# Altium schematic sheet Sheet1.SchDoc
size 635 x 508 mm; SheetNumber: 1; SheetTotal: 12
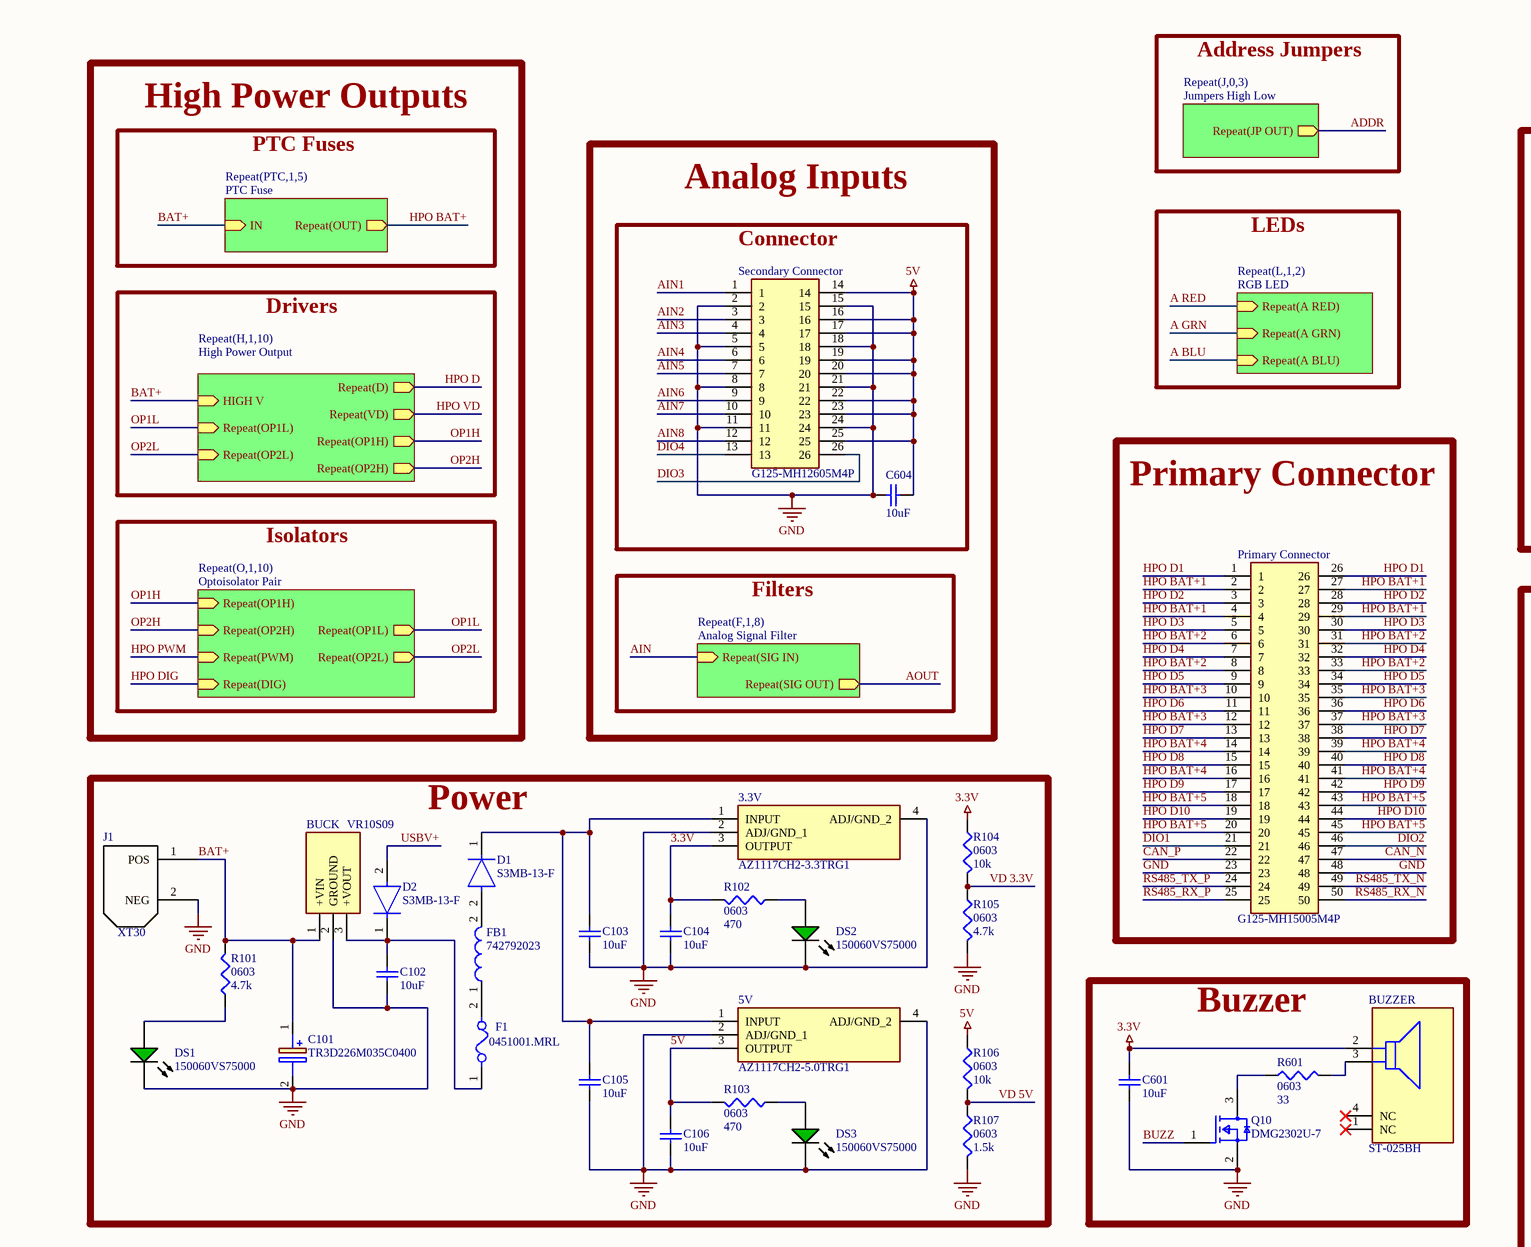
[diagram p0: Sheet1.SchDoc, top left]
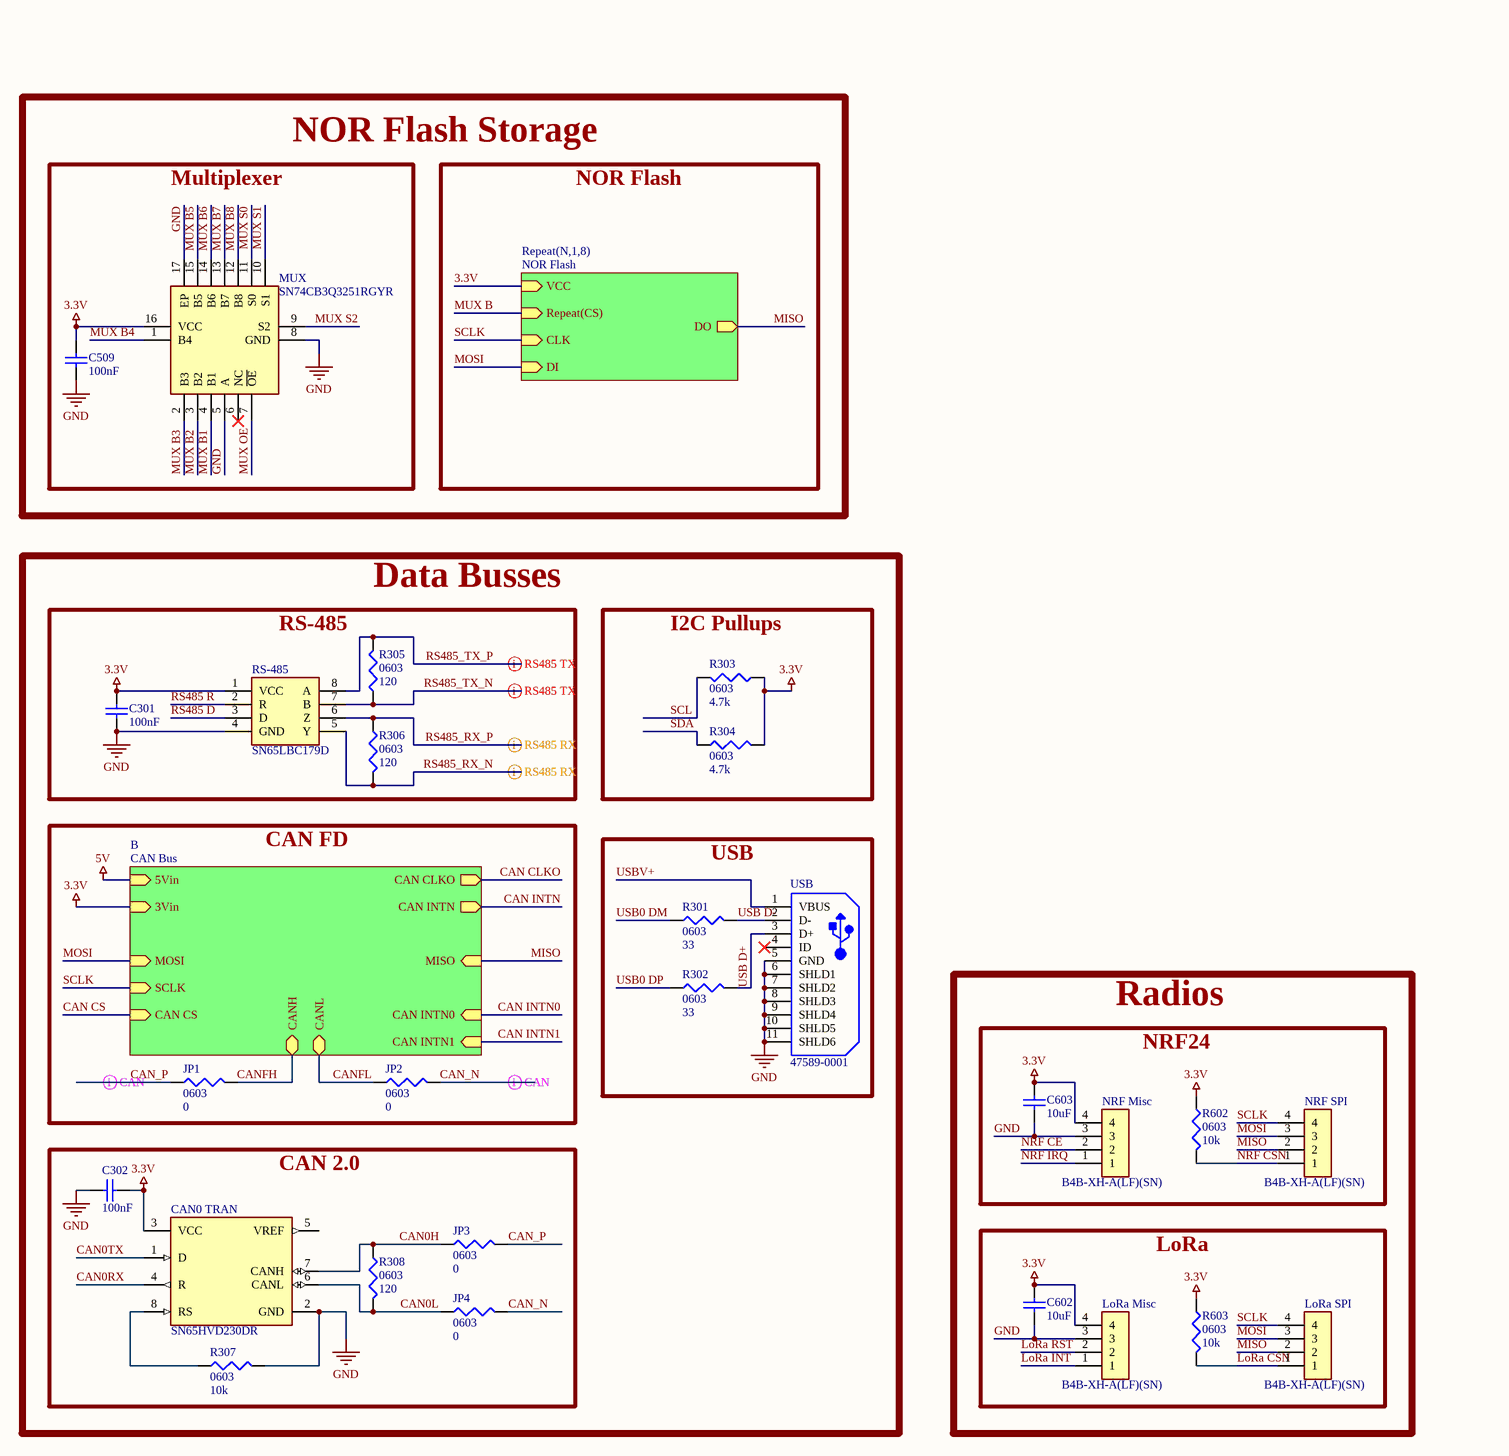
[diagram p1: Sheet1.SchDoc, top right]
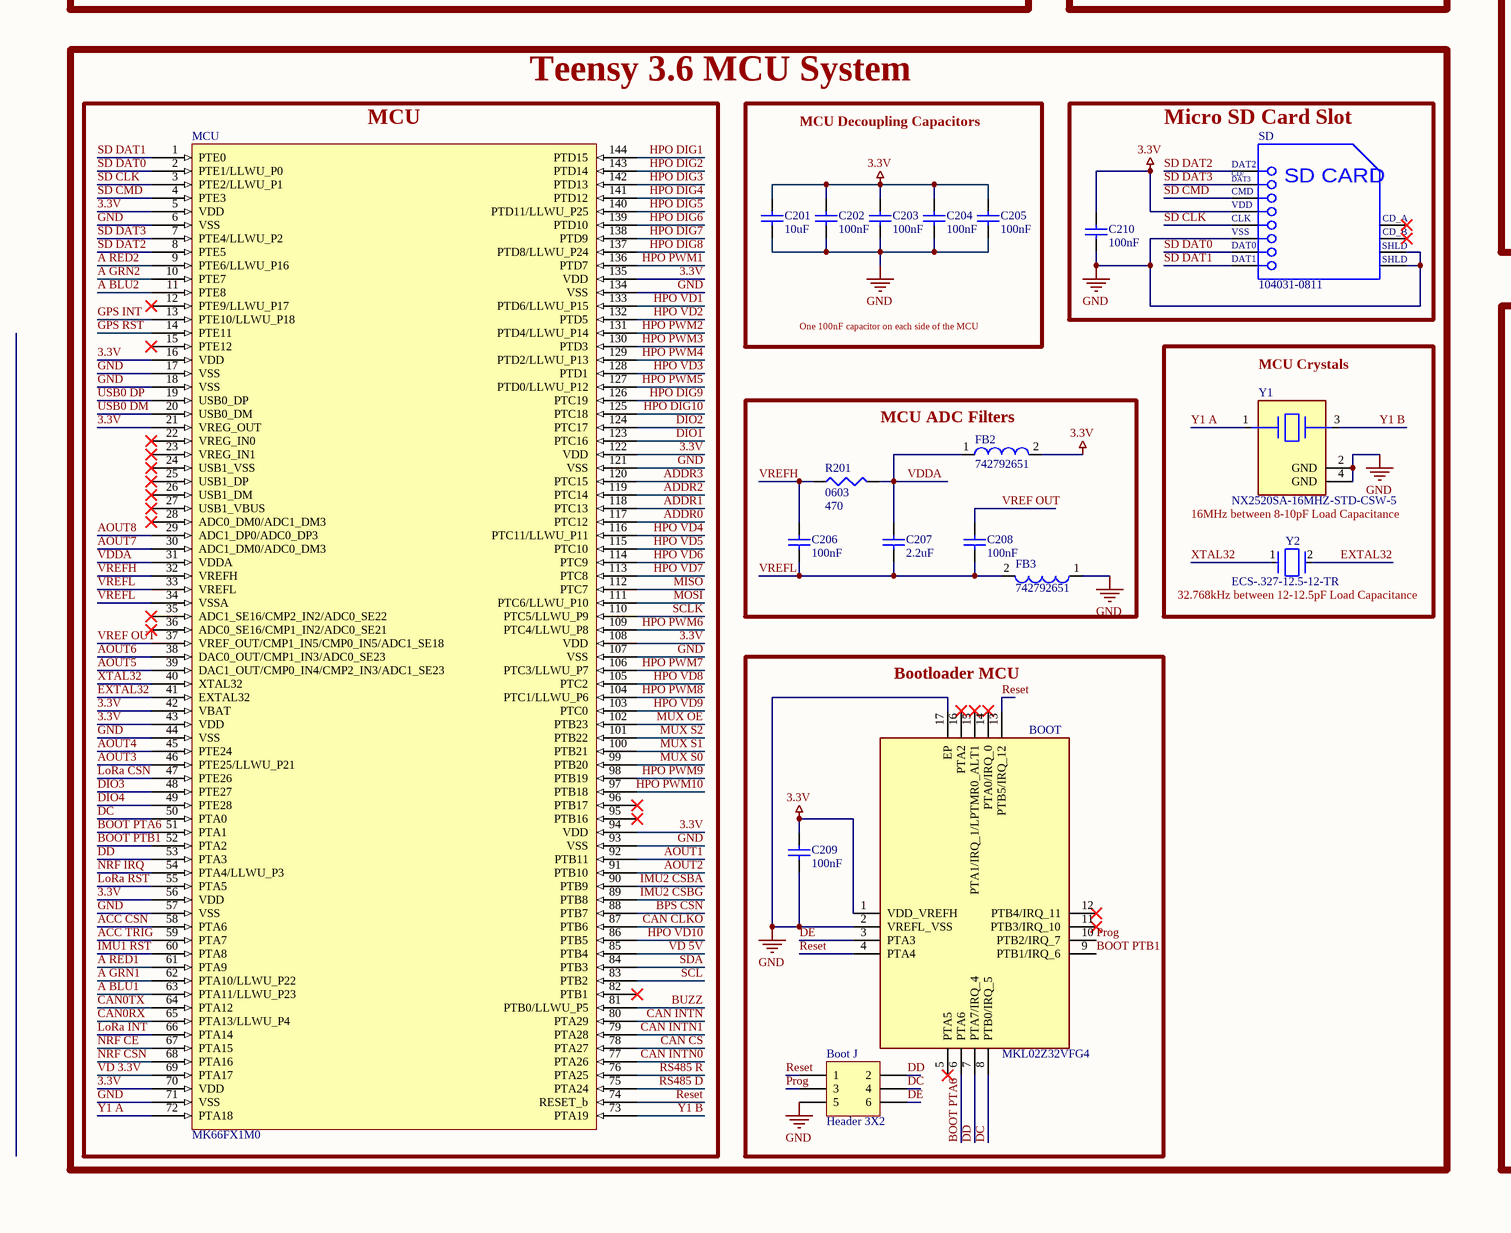
[diagram p2: Sheet1.SchDoc, bottom left]
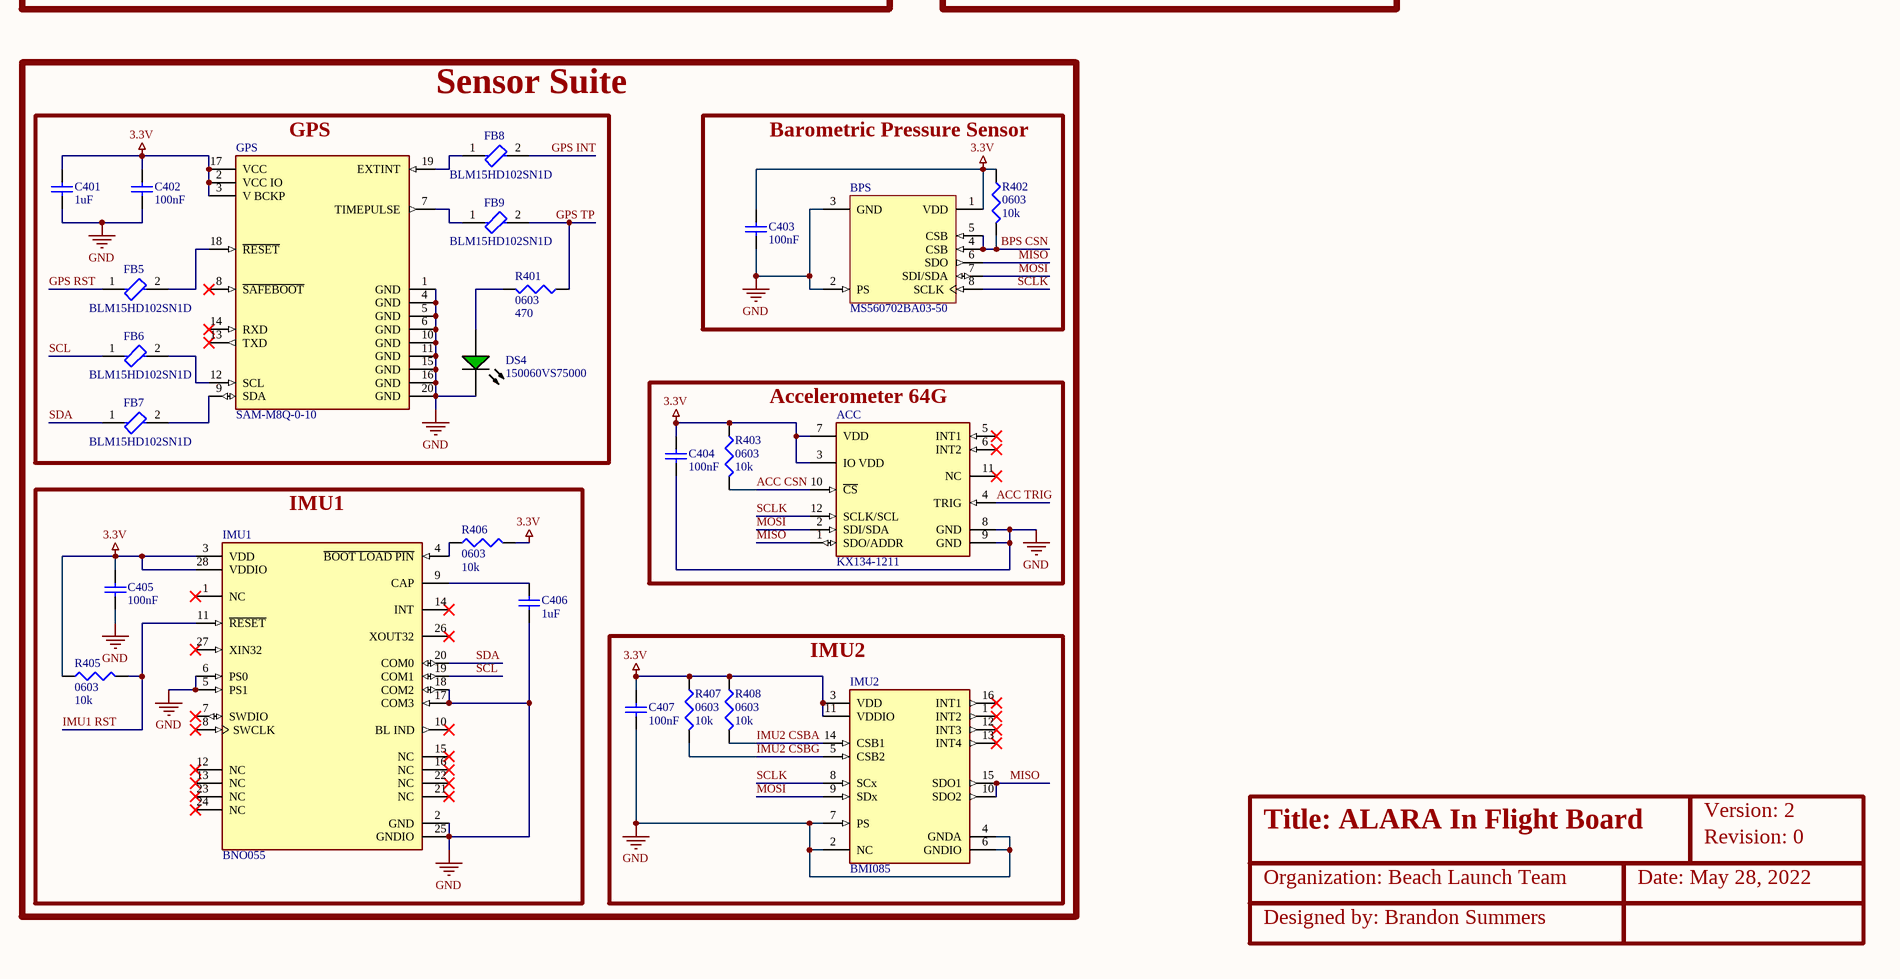
[diagram p3: Sheet1.SchDoc, bottom right]

## Parts
3.3V  AZ1117CH2-3.3TRG1  [SOT230P700X180-4N]
5V  AZ1117CH2-5.0TRG1  [SOT230P700X180-4N]
ACC  KX134-1211  [FP-KX134-1211-MFG]
BOOT  MKL02Z32VFG4  [QFN50P300X300X65-17N-D]
Boot_J  Header 3X2  [HDR2X3]
BPS  MS560702BA03-50  [TECO-MS560702BA03-50_V]
BUCK  VR10S09  [VR10S09]
BUZZER  ST-025BH  [FP-ST-025BH-MFG]
C101  TR3D226M035C0400  [CAPPM7343X310N]
C102  10uF  [CAPC1608X95X40ML15T15]
C103  10uF  [CAPC1608X95X40ML15T15]
C104  10uF  [CAPC1608X95X40ML15T15]
C105  10uF  [CAPC1608X95X40ML15T15]
C106  10uF  [CAPC1608X95X40ML15T15]
C201  10uF  [CAPC1608X95X40ML15T15]
C202  100nF  [CAPC1608X95X40ML15T15]
C203  100nF  [CAPC1608X95X40ML15T15]
C204  100nF  [CAPC1608X95X40ML15T15]
C205  100nF  [CAPC1608X95X40ML15T15]
C206  100nF  [CAPC1608X95X40ML15T15]
C207  2.2uF  [CAPC1608X95X40ML15T15]
C208  100nF  [CAPC1608X95X40ML15T15]
C209  100nF  [CAPC1608X95X40ML15T15]
C210  100nF  [CAPC1608X95X40ML15T15]
C301  100nF  [CAPC1608X95X40ML15T15]
C302  100nF  [CAPC1608X95X40ML15T15]
C401  1uF  [CAPC1608X95X40ML15T15]
C402  100nF  [CAPC1608X95X40ML15T15]
C403  100nF  [CAPC1608X95X40ML15T15]
C404  100nF  [CAPC1608X95X40ML15T15]
C405  100nF  [CAPC1608X95X40ML15T15]
C406  1uF  [CAPC1608X95X40ML15T15]
C407  100nF  [CAPC1608X95X40ML15T15]
C509  100nF  [CAPC1608X95X40ML15T15]
C601  10uF  [CAPC1608X95X40ML15T15]
C602  10uF  [CAPC1608X95X40ML15T15]
C603  10uF  [CAPC1608X95X40ML15T15]
C604  10uF  [CAPC1608X95X40ML15T15]
CAN0_TRAN  SN65HVD230DR  [FP-D0008A-IPC_A]
D1  S3MB-13-F  [FP-SMB-MFG]
D2  S3MB-13-F  [FP-SMB-MFG]
DS1  150060VS75000  [WE-150060VS75000_V]
DS2  150060VS75000  [WE-150060VS75000_V]
DS3  150060VS75000  [WE-150060VS75000_V]
DS4  150060VS75000  [WE-150060VS75000_V]
F1  0451001.MRL  [FP-0451-MFG]
FB1  742792023  [SMD-0805]
FB2  742792651  [SMD-0603]
FB3  742792651  [SMD-0603]
FB5  BLM15HD102SN1D  [FP-BLM15-0_05-IPC_C]
FB6  BLM15HD102SN1D  [FP-BLM15-0_05-IPC_C]
FB7  BLM15HD102SN1D  [FP-BLM15-0_05-IPC_C]
FB8  BLM15HD102SN1D  [FP-BLM15-0_05-IPC_C]
FB9  BLM15HD102SN1D  [FP-BLM15-0_05-IPC_C]
GPS  SAM-M8Q-0-10  [FP-SAM-M8Q-0-10-MFG]
IMU1  BNO055  [FP-BNO055-MFG]
IMU2  BMI085  [FP-BMI055-MFG]
J1  XT30  [XT30]
JP1  0603  value 0  [J1-0603]
JP2  0603  value 0  [J1-0603]
JP3  0603  value 0  [J1-0603]
JP4  0603  value 0  [J1-0603]
LoRa_Misc  B4B-XH-A(LF)(SN)  [JST_B4B-XH-A(LF)(SN)]
LoRa_SPI  B4B-XH-A(LF)(SN)  [JST_B4B-XH-A(LF)(SN)]
MCU  MK66FX1M0  [LQFP144 0.5mm Pitch]
MUX  SN74CB3Q3251RGYR  [SN74CBT3257CRGYR]
NRF_Misc  B4B-XH-A(LF)(SN)  [JST_B4B-XH-A(LF)(SN)]
NRF_SPI  B4B-XH-A(LF)(SN)  [JST_B4B-XH-A(LF)(SN)]
Primary_Connector  G125-MH15005M4P  [G125-MH15005M4P]
Q10  DMG2302U-7  [FP-SOT23-MFG]
R101  0603  value 4.7k  [J1-0603]
R102  0603  value 470  [J1-0603]
R103  0603  value 470  [J1-0603]
R104  0603  value 10k  [J1-0603]
R105  0603  value 4.7k  [J1-0603]
R106  0603  value 10k  [J1-0603]
R107  0603  value 1.5k  [J1-0603]
R201  0603  value 470  [J1-0603]
R301  0603  value 33  [J1-0603]
R302  0603  value 33  [J1-0603]
R303  0603  value 4.7k  [J1-0603]
R304  0603  value 4.7k  [J1-0603]
R305  0603  value 120  [J1-0603]
R306  0603  value 120  [J1-0603]
R307  0603  value 10k  [J1-0603]
R308  0603  value 120  [J1-0603]
R401  0603  value 470  [J1-0603]
R402  0603  value 10k  [J1-0603]
R403  0603  value 10k  [J1-0603]
R405  0603  value 10k  [J1-0603]
R406  0603  value 10k  [J1-0603]
R407  0603  value 10k  [J1-0603]
R408  0603  value 10k  [J1-0603]
R601  0603  value 33  [J1-0603]
R602  0603  value 10k  [J1-0603]
R603  0603  value 10k  [J1-0603]
RS-485  SN65LBC179D  [SOIC127P600X175-8N]
SD  104031-0811  [MOLX-104031-0811_V]
Secondary_Connector  G125-MH12605M4P  [G125-MH12605M4P]
USB  47589-0001  [MOLX-47589-0001_V]
Y1  NX2520SA-16MHZ-STD-CSW-5  [FP-NX2520SA-MFG]
Y2  ECS-.327-12.5-12-TR  [FP-ECX-12-MFG]

## Blocks framed on the sheet
NOR Flash Storage: C509 MUX
Connector: C604 Secondary_Connector
Primary Connector: Primary_Connector
Data Busses: C301 R305 R306 RS-485
I2C Pullups: R303 R304
Power: 3.3V 5V BUCK C101-C106 D1 D2 DS1-DS3 F1 FB1 J1 R101-R107
CAN FD: JP1 JP2
USB: R301 R302 USB
Buzzer: BUZZER C601 Q10 R601
Radios: C603 NRF_Misc NRF_SPI R602
CAN 2.0: C302 CAN0_TRAN JP3 JP4 R307 R308
LoRa: C602 LoRa_Misc LoRa_SPI R603
Teensy 3.6 MCU System: MCU
MCU Decoupling Capacitors: C201-C205
Micro SD Card Slot: C210 SD
MCU Crystals: Y1 Y2
Sensor Suite: C401 C402 DS4 FB5-FB9 GPS R401
Barometric Pressure Sensor: BPS C403 R402
MCU ADC Filters: C206-C208 FB2 FB3 R201
Accelerometer 64G: ACC C404 R403
Bootloader MCU: BOOT Boot_J C209
IMU1: C405 C406 IMU1 R405 R406
IMU2: C407 IMU2 R407 R408

## Sub-sheets
B = CAN Bus: 5Vin (in), 3Vin (in), CANH (bidir), CANL (bidir), CAN CLKO (out), CAN INTN (out), SCLK (in), MOSI (in), CAN CS (in), MISO (in), CAN INTN0 (in), CAN INTN1 (in)
Repeat(F,1,8) = Analog Signal Filter: Repeat(SIG IN) (in), Repeat(SIG OUT) (out)
Repeat(H,1,10) = High Power Output: Repeat(VD) (out), Repeat(D) (out), HIGH V (in), Repeat(OP1L) (in), Repeat(OP2L) (in), Repeat(OP1H) (out), Repeat(OP2H) (out)
Repeat(J,0,3) = Jumpers High Low: Repeat(JP OUT) (out)
Repeat(L,1,2) = RGB LED: Repeat(A RED) (in), Repeat(A GRN) (in), Repeat(A BLU) (in)
Repeat(N,1,8) = NOR Flash: Repeat(CS) (in), DI (in), DO (out), CLK (in), VCC (in)
Repeat(O,1,10) = Optoisolator Pair: Repeat(PWM) (in), Repeat(DIG) (in), Repeat(OP1H) (in), Repeat(OP1L) (out), Repeat(OP2H) (in), Repeat(OP2L) (out)
Repeat(PTC,1,5) = PTC Fuse: IN (in), Repeat(OUT) (out)

## Nets
3.3V: 3.3V.3(OUTPUT) ACC.3(IO_VDD) ACC.7(VDD) BOOT.1(VDD_VREFH) BPS.1(VDD) BUZZER.2(+POLARITY) C104.2 C201.2 C202.2 C203.2 C204.2 C205.2 C209.2 C210.2 C301.2 C302.2 C401.2 C402.2 C403.2 C404.2 C405.2 C407.2 C509.1 C601.2 C602.2 C603.2 CAN0_TRAN.3(VCC) FB2.2 GPS.2(VCC_IO) GPS.3(V_BCKP) GPS.17(VCC) IMU1.3(VDD) IMU1.28(VDDIO) IMU2.3(VDD) IMU2.11(VDDIO) LoRa_Misc.4 MCU.5(VDD) MCU.16(VDD) MCU.21(VREG_OUT) MCU.42(VBAT) MCU.43(VDD) MCU.56(VDD) MCU.70(VDD) MCU.94(VDD) MCU.108(VDD) MCU.122(VDD) MCU.135(VDD) MUX.16(VCC) NRF_Misc.4 R102.2 R104.1 R303.1 R304.2 R402.1 R403.1 R405.1 R406.2 R407.1 R408.1 R602.1 R603.1 RS-485.1(VCC) SD.4(VDD) ; sheet Repeat(N,1,8)/VCC, sheet B/3Vin
5V: 5V.3(OUTPUT) C106.2 C604.2 R103.2 R106.1 Secondary_Connector.14 Secondary_Connector.16 Secondary_Connector.17 Secondary_Connector.19 Secondary_Connector.20 Secondary_Connector.22 Secondary_Connector.23 Secondary_Connector.25 ; sheet B/5Vin
GND: 3.3V.2(ADJ/GND_1) 3.3V.4(ADJ/GND_2) 5V.2(ADJ/GND_1) 5V.4(ADJ/GND_2) ACC.8(GND) ACC.9(GND) BOOT.2(VREFL_VSS) BOOT.17(EP) Boot_J.5 BPS.2(PS) BPS.3(GND) BUCK.2(GROUND) C101.2(-) C102.1 C103.1 C104.1 C105.1 C106.1 C201.1 C202.1 C203.1 C204.1 C205.1 C209.1 C210.1 C301.1 C302.1 C401.1 C402.1 C403.1 C404.1 C405.1 C406.1 C407.1 C509.2 C601.1 C602.1 C603.1 C604.1 CAN0_TRAN.2(GND) DS1.1(K) DS2.1(K) DS3.1(K) DS4.1(K) FB3.1 GPS.1(GND) GPS.4(GND) GPS.5(GND) GPS.6(GND) GPS.10(GND) GPS.11(GND) GPS.15(GND) GPS.16(GND) GPS.20(GND) IMU1.2(GND) IMU1.5(PS1) IMU1.6(PS0) IMU1.17(COM3) IMU1.18(COM2) IMU1.25(GNDIO) IMU2.2(NC) IMU2.4(GNDA) IMU2.6(GNDIO) IMU2.7(PS) J1.2(NEG) LoRa_Misc.3 MCU.6(VSS) MCU.17(VSS) MCU.18(VSS) MCU.44(VSS) MCU.57(VSS) MCU.71(VSS) MCU.93(VSS) MCU.107(VSS) MCU.121(VSS) MCU.134(VSS) MUX.5(A) MUX.8(GND) MUX.17(EP) NRF_Misc.3 Primary_Connector.23 Primary_Connector.48 Q10.2(S) R105.2 R107.2 R307.2 RS-485.4(GND) SD.6(VSS2) SD.11(SHLD1) SD.12(SHLD2) Secondary_Connector.2 Secondary_Connector.5 Secondary_Connector.8 Secondary_Connector.11 Secondary_Connector.15 Secondary_Connector.18 Secondary_Connector.21 Secondary_Connector.24 USB.5(GND) USB.6(SHLD1) USB.7(SHLD2) USB.8(SHLD3) USB.9(SHLD4) USB.10(SHLD5) USB.11(SHLD6) Y1.2(GND) Y1.4(GND)
A BLU: sheet Repeat(L,1,2)/Repeat(A BLU)
A BLU1: MCU.63(PTA11/LLWU_P23)
A BLU2: MCU.11(PTE8)
A GRN: sheet Repeat(L,1,2)/Repeat(A GRN)
A GRN1: MCU.62(PTA10/LLWU_P22)
A GRN2: MCU.10(PTE7)
A RED: sheet Repeat(L,1,2)/Repeat(A RED)
A RED1: MCU.61(PTA9)
A RED2: MCU.9(PTE6/LLWU_P16)
ACC CSN: ACC.10(~{CS}) MCU.58(PTA6) R403.2
ACC TRIG: ACC.4(TRIG) MCU.59(PTA7)
ADDR: sheet Repeat(J,0,3)/Repeat(JP OUT)
ADDR0: MCU.117(PTC12)
ADDR1: MCU.118(PTC13)
ADDR2: MCU.119(PTC14)
ADDR3: MCU.120(PTC15)
AIN: sheet Repeat(F,1,8)/Repeat(SIG IN)
AIN1: Secondary_Connector.1
AIN2: Secondary_Connector.3
AIN3: Secondary_Connector.4
AIN4: Secondary_Connector.6
AIN5: Secondary_Connector.7
AIN6: Secondary_Connector.9
AIN7: Secondary_Connector.10
AIN8: Secondary_Connector.12
AOUT: sheet Repeat(F,1,8)/Repeat(SIG OUT)
AOUT1: MCU.92(PTB11)
AOUT2: MCU.91(PTB10)
AOUT3: MCU.46(PTE25/LLWU_P21)
AOUT4: MCU.45(PTE24)
AOUT5: MCU.39(DAC1_OUT/CMP0_IN4/CMP2_IN3/ADC1_SE23)
AOUT6: MCU.38(DAC0_OUT/CMP1_IN3/ADC0_SE23)
AOUT7: MCU.30(ADC1_DM0/ADC0_DM3)
AOUT8: MCU.29(ADC1_DP0/ADC0_DP3)
BAT+: BUCK.1(+VIN) C101.1(+) J1.1(POS) R101.2 ; sheet Repeat(H,1,10)/HIGH V, sheet Repeat(PTC,1,5)/IN
BOOT PTA6: BOOT.6(PTA6) MCU.51(PTA1)
BOOT PTB1: BOOT.9(PTB1/IRQ_6) MCU.52(PTA2)
BPS CSN: BPS.4(CSB) BPS.5(CSB) MCU.88(PTB7) R402.2
BUZZ: MCU.81(PTB0/LLWU_P5) Q10.1(G)
CAN0H: CAN0_TRAN.7(CANH) JP3.1 R308.1
CAN0L: CAN0_TRAN.6(CANL) JP4.1 R308.2
CAN0RX: CAN0_TRAN.4(R) MCU.65(PTA13/LLWU_P4)
CAN0TX: CAN0_TRAN.1(D) MCU.64(PTA12)
CAN CLKO: MCU.87(PTB6) ; sheet B/CAN CLKO
CAN CS: MCU.78(PTA27) ; sheet B/CAN CS
CAN INTN: MCU.80(PTA29) ; sheet B/CAN INTN
CAN INTN0: MCU.77(PTA26) ; sheet B/CAN INTN0
CAN INTN1: MCU.79(PTA28) ; sheet B/CAN INTN1
CAN_N: JP2.2 JP4.2 Primary_Connector.47
CAN_P: JP1.1 JP3.2 Primary_Connector.22
CANFH: JP1.2 ; sheet B/CANH
CANFL: JP2.1 ; sheet B/CANL
DC: BOOT.8(PTB0/IRQ_5) Boot_J.4 MCU.50(PTA0)
DD: BOOT.7(PTA7/IRQ_4) Boot_J.2 MCU.53(PTA3)
DE: BOOT.3(PTA3) Boot_J.6
DIO1: MCU.123(PTC16) Primary_Connector.21
DIO2: MCU.124(PTC17) Primary_Connector.46
DIO3: MCU.48(PTE27) Secondary_Connector.26
DIO4: MCU.49(PTE28) Secondary_Connector.13
EXTAL32: MCU.41(EXTAL32) Y2.2(Out/In)
GPS INT: FB8.2 MCU.13(PTE10/LLWU_P18)
GPS RST: FB5.1 MCU.14(PTE11)
GPS TP: FB9.2 R401.1
HPO BAT+: sheet Repeat(PTC,1,5)/Repeat(OUT)
HPO BAT+1: Primary_Connector.2 Primary_Connector.4 Primary_Connector.27 Primary_Connector.29
HPO BAT+2: Primary_Connector.6 Primary_Connector.8 Primary_Connector.31 Primary_Connector.33
HPO BAT+3: Primary_Connector.10 Primary_Connector.12 Primary_Connector.35 Primary_Connector.37
HPO BAT+4: Primary_Connector.14 Primary_Connector.16 Primary_Connector.39 Primary_Connector.41
HPO BAT+5: Primary_Connector.18 Primary_Connector.20 Primary_Connector.43 Primary_Connector.45
HPO D: sheet Repeat(H,1,10)/Repeat(D)
HPO D1: Primary_Connector.1 Primary_Connector.26
HPO D2: Primary_Connector.3 Primary_Connector.28
HPO D3: Primary_Connector.5 Primary_Connector.30
HPO D4: Primary_Connector.7 Primary_Connector.32
HPO D5: Primary_Connector.9 Primary_Connector.34
HPO D6: Primary_Connector.11 Primary_Connector.36
HPO D7: Primary_Connector.13 Primary_Connector.38
HPO D8: Primary_Connector.15 Primary_Connector.40
HPO D9: Primary_Connector.17 Primary_Connector.42
HPO D10: Primary_Connector.19 Primary_Connector.44
HPO DIG: sheet Repeat(O,1,10)/Repeat(DIG)
HPO DIG1: MCU.144(PTD15)
HPO DIG2: MCU.143(PTD14)
HPO DIG3: MCU.142(PTD13)
HPO DIG4: MCU.141(PTD12)
HPO DIG5: MCU.140(PTD11/LLWU_P25)
HPO DIG6: MCU.139(PTD10)
HPO DIG7: MCU.138(PTD9)
HPO DIG8: MCU.137(PTD8/LLWU_P24)
HPO DIG9: MCU.126(PTC19)
HPO DIG10: MCU.125(PTC18)
HPO PWM: sheet Repeat(O,1,10)/Repeat(PWM)
HPO PWM1: MCU.136(PTD7)
HPO PWM2: MCU.131(PTD4/LLWU_P14)
HPO PWM3: MCU.130(PTD3)
HPO PWM4: MCU.129(PTD2/LLWU_P13)
HPO PWM5: MCU.127(PTD0/LLWU_P12)
HPO PWM6: MCU.109(PTC4/LLWU_P8)
HPO PWM7: MCU.106(PTC3/LLWU_P7)
HPO PWM8: MCU.104(PTC1/LLWU_P6)
HPO PWM9: MCU.98(PTB19)
HPO PWM10: MCU.97(PTB18)
HPO VD: sheet Repeat(H,1,10)/Repeat(VD)
HPO VD1: MCU.133(PTD6/LLWU_P15)
HPO VD2: MCU.132(PTD5)
HPO VD3: MCU.128(PTD1)
HPO VD4: MCU.116(PTC11/LLWU_P11)
HPO VD5: MCU.115(PTC10)
HPO VD6: MCU.114(PTC9)
HPO VD7: MCU.113(PTC8)
HPO VD8: MCU.105(PTC2)
HPO VD9: MCU.103(PTC0)
HPO VD10: MCU.86(PTB5)
IMU1 RST: IMU1.11(~{RESET}) MCU.60(PTA8) R405.2
IMU2 CSBA: IMU2.14(CSB1) MCU.90(PTB9) R408.2
IMU2 CSBG: IMU2.5(CSB2) MCU.89(PTB8) R407.2
LoRa CSN: LoRa_SPI.1 MCU.47(PTE26) R603.2
LoRa INT: LoRa_Misc.1 MCU.66(PTA14)
LoRa RST: LoRa_Misc.2 MCU.55(PTA5)
MISO: ACC.1(SDO/ADDR) BPS.6(SDO) IMU2.10(SDO2) IMU2.15(SDO1) LoRa_SPI.2 MCU.112(PTC7) NRF_SPI.2 ; sheet Repeat(N,1,8)/DO, sheet B/MISO
MOSI: ACC.2(SDI/SDA) BPS.7(SDI/SDA) IMU2.9(SDx) LoRa_SPI.3 MCU.111(PTC6/LLWU_P10) NRF_SPI.3 ; sheet Repeat(N,1,8)/DI, sheet B/MOSI
MUX B: sheet Repeat(N,1,8)/Repeat(CS)
MUX B1: MUX.4(B1)
MUX B2: MUX.3(B2)
MUX B3: MUX.2(B3)
MUX B4: MUX.1(B4)
MUX B5: MUX.15(B5)
MUX B6: MUX.14(B6)
MUX B7: MUX.13(B7)
MUX B8: MUX.12(B8)
MUX OE: MCU.102(PTB23) MUX.7(~{OE})
MUX S0: MCU.99(PTB20) MUX.11(S0)
MUX S1: MCU.100(PTB21) MUX.10(S1)
MUX S2: MCU.101(PTB22) MUX.9(S2)
NRF CE: MCU.67(PTA15) NRF_Misc.2
NRF CSN: MCU.68(PTA16) NRF_SPI.1 R602.2
NRF IRQ: MCU.54(PTA4/LLWU_P3) NRF_Misc.1
OP1H: sheet Repeat(H,1,10)/Repeat(OP1H), sheet Repeat(O,1,10)/Repeat(OP1H)
OP1L: sheet Repeat(H,1,10)/Repeat(OP1L), sheet Repeat(O,1,10)/Repeat(OP1L)
OP2H: sheet Repeat(H,1,10)/Repeat(OP2H), sheet Repeat(O,1,10)/Repeat(OP2H)
OP2L: sheet Repeat(H,1,10)/Repeat(OP2L), sheet Repeat(O,1,10)/Repeat(OP2L)
Prog: BOOT.10(PTB2/IRQ_7) Boot_J.3
Reset: BOOT.4(PTA4) BOOT.13(PTB5/IRQ_12) Boot_J.1 MCU.74(RESET_b)
RS485 D: MCU.75(PTA24) RS-485.3(D)
RS485 R: MCU.76(PTA25) RS-485.2(R)
RS485_RX_N: Primary_Connector.50 R306.2 RS-485.5(Y)
RS485_RX_P: Primary_Connector.25 R306.1 RS-485.6(Z)
RS485_TX_N: Primary_Connector.49 R305.1 RS-485.7(B)
RS485_TX_P: Primary_Connector.24 R305.2 RS-485.8(A)
SCL: FB6.1 IMU1.19(COM1) MCU.83(PTB2) R303.2
SCLK: ACC.12(SCLK/SCL) BPS.8(SCLK) IMU2.8(SCx) LoRa_SPI.4 MCU.110(PTC5/LLWU_P9) NRF_SPI.4 ; sheet Repeat(N,1,8)/CLK, sheet B/SCLK
SD CLK: MCU.3(PTE2/LLWU_P1) SD.5(CLK)
SD CMD: MCU.4(PTE3) SD.3(VSS1)
SD DAT0: MCU.2(PTE1/LLWU_P0) SD.7(DAT0)
SD DAT1: MCU.1(PTE0) SD.8(DAT1)
SD DAT2: MCU.8(PTE5) SD.1(CD/DAT3)
SD DAT3: MCU.7(PTE4/LLWU_P2) SD.2(CMD)
SDA: FB7.1 IMU1.20(COM0) MCU.84(PTB3) R304.1
USB0 DM: MCU.20(USB0_DM) R301.1
USB0 DP: MCU.19(USB0_DP) R302.1
USB D+: R302.2 USB.3(D+)
USB D-: R301.2 USB.2(D-)
USBV+: D2.2(A) USB.1(VBUS)
VD 3.3V: MCU.69(PTA17) R104.2 R105.1
VD 5V: MCU.85(PTB4) R106.2 R107.1
VDDA: C207.2 FB2.1 MCU.31(VDDA) R201.2
VREF OUT: C208.2 MCU.37(VREF_OUT/CMP1_IN5/CMP0_IN5/ADC1_SE18)
VREFH: C206.2 MCU.32(VREFH) R201.1
VREFL: C206.1 C207.1 C208.1 FB3.2 MCU.33(VREFL) MCU.34(VSSA)
XTAL32: MCU.40(XTAL32) Y2.1(In/Out)
Y1 A: MCU.72(PTA18) Y1.1
Y1 B: MCU.73(PTA19) Y1.3
Net3.3V_1: 3.3V.1(INPUT) 5V.1(INPUT) C103.2 C105.2 D1.1(C)
NetBUCK_3: BUCK.3(+VOUT) C102.2 D2.1(C) F1.1
NetBUZZER_3: BUZZER.3(-POLARITY) R601.2
NetC406_2: C406.2 IMU1.9(CAP)
NetCAN0_TRAN_8: CAN0_TRAN.8(RS) R307.1
NetD1_2: D1.2(A) FB1.2
NetDS1_2: DS1.2(A) R101.1
NetDS2_2: DS2.2(A) R102.1
NetDS3_2: DS3.2(A) R103.1
NetDS4_2: DS4.2(A) R401.2
NetF1_2: F1.2 FB1.1
NetFB5_2: FB5.2 GPS.18(~{RESET})
NetFB6_2: FB6.2 GPS.12(SCL)
NetFB7_2: FB7.2 GPS.9(SDA)
NetFB8_1: FB8.1 GPS.19(EXTINT)
NetFB9_1: FB9.1 GPS.7(TIMEPULSE)
NetIMU1_4: IMU1.4(~{BOOT_LOAD_PIN}) R406.1
NetQ10_3: Q10.3(D) R601.1

Not connected (* = marked no-connect by the designer): ACC 5(INT1)* 6(INT2)* 11(NC)*; BOOT 5(PTA5)* 11(PTB3/IRQ_10)* 12(PTB4/IRQ_11)* 14(PTA0/IRQ_0)* 15(PTA1/IRQ_1/LPTMR0_ALT1)* 16(PTA2)*; BUZZER 1(NC)* 4(NC)*; CAN0_TRAN 5(VREF); GPS 8(~{SAFEBOOT})* 13(TXD)* 14(RXD)*; IMU1 1(NC)* 7(SWDIO)* 8(SWCLK)* 10(BL_IND)* 12(NC)* 13(NC)* 14(INT)* 15(NC)* 16(NC)* 21(NC)* 22(NC)* 23(NC)* 24(NC)* 26(XOUT32)* 27(XIN32)*; IMU2 1(INT2)* 12(INT3)* 13(INT4)* 16(INT1)*; MCU 12(PTE9/LLWU_P17)* 15(PTE12)* 22(VREG_IN0)* 23(VREG_IN1)* 24(USB1_VSS)* 25(USB1_DP)* 26(USB1_DM)* 27(USB1_VBUS)* 28(ADC0_DM0/ADC1_DM3)* 35(ADC1_SE16/CMP2_IN2/ADC0_SE22)* 36(ADC0_SE16/CMP1_IN2/ADC0_SE21)* 82(PTB1)* 95(PTB16)* 96(PTB17)*; MUX 6(NC)*; SD 9(CD_A)* 10(CD_B)*; USB 4(ID)*

## Layout directives
differential pair: CAN_N, CAN_P, RS485_RX_N, RS485_RX_P, RS485_TX_N, RS485_TX_P

## Notes on the sheet
- Address Jumpers
- High Power Outputs
- PTC Fuses
- Analog Inputs
- LEDs
- Multiplexer
- NOR Flash
- Drivers
- Isolators
- Filters
- (near R305) RS-485
- NRF24
- (near MCU) MCU
- One 100nF capacitor on each side of the MCU
- (near GPS) GPS
- 16MHz between 8-10pF Load Capacitance
- (near Y2) 32.768kHz between 12-12.5pF Load Capacitance
- Title: ALARA In Flight Board
- Version: 2
- Revision: 0
- Designed by: Brandon Summers
- Organization: Beach Launch Team
- Date: May 28, 2022
- (in symbol CMP-2000-05825-1) DAT2; CD/; DAT3; SD CARD; VSS; SHLD

## Library data of the parts
3.3V = AZ1117CH2-3.3TRG1: Integrated Circuit; Manufacturer_Name: Diodes Inc.; Datasheet Link: https://www.arrow.com/en/products/az1117ch2-3.3trg1/diodes-incorporated; Height: 1.8mm; Manufacturer_Part_Number: AZ1117CH2-3.3TRG1
5V = AZ1117CH2-5.0TRG1: Integrated Circuit; Manufacturer_Name: Diodes Inc.; Datasheet Link: https://www.arrow.com/en/products/az1117ch2-5.0trg1/diodes-incorporated; Height: 1.8mm; Manufacturer_Part_Number: AZ1117CH2-5.0TRG1
ACC = CMP-223024-000001-1: 105C OPERATING HIGHER BANDWIDTH,
BOOT = MKL02Z32VFG4: Integrated Circuit; Manufacturer_Name: NXP; Datasheet Link: http://www.nxp.com/docs/en/data-sheet/KL02P32M48SF0.pdf; Height: 0.65mm; Manufacturer_Part_Number: MKL02Z32VFG4; Mouser Part Number: 841-MKL02Z32VFG4; Mouser Price/Stock: https://www.mouser.co.uk/ProductDetail/NXP-Semiconductors/MKL02Z32VFG4?qs=RECgZY%252BK1xLpPFD7GzHxWg%3D%3D; Arrow Part Number: MKL02Z32VFG4; Arrow Price/Stock: https://www.arrow.com/en/products/mkl02z32vfg4/nxp-semiconductors
Boot_J = Header 3X2: Header, 3-Pin, Dual row; LatestRevisionDate: 17-Jul-2002; LatestRevisionNote: Re-released for DXP Platform.; Publisher: Altium Limited
BPS = CMP-2000-07512-1: Barometric Pressure Sensor, with Stainless Steel Cap , 1.8 to 3.6 V, -40 to 85 degC, 8-Pin SMD, RoHS, Tape and Reel; Manufacturer: TE Connectivity; Lead Free: LeadFree; RoHSCompliant: false; Mounting Technology: SurfaceMount; Datasheet URL: http://www.te.com/commerce/DocumentDelivery/DDEController?Action=showdoc&DocId=Data+Sheet%7FMS5607-02BA03%7FB2%7Fpdf%7FEnglish%7FENG_DS_MS5607-02BA03_B2.pdf%7FMS560702BA03-50; Manufacturer URL: http://www.te.com/; Package Description: 8-Pin Surface Mount Device, Body 3 x 5 mm, Pitch 1.25 mm; Package Reference: MS560702BA03-50; Datasheet Version: 06/2017
BUCK = VR10S09: Power Supply; Manufacturer_Name: XP POWER; Datasheet Link: https://www.xppower.com/portals/0/pdfs/SF_VR10.pdf; Height: 10.9mm; Manufacturer_Part_Number: VR10S09
BUZZER = CMP-247804-000002-1: AUDIO MAGNETIC XDCR 2-4V SMD; Manufacturer: Soberton Inc.; Frequency: 2700Hz; Max Supply Voltage: 4.5V; Operating Supply Voltage: 3.6V; Current: 100mA; Min Supply Voltage: 2.5V; Octopart: https://octopart.com/st-025bh-soberton-22171825; Package: ST-025BH; Device Class L2: Audio Products; Device Class L3: Buzzers; ComponentLink2URL: https://www.soberton.com/wp-content/uploads/2019/02/ST-025BH-19-Feb-2019.pdf; Digikey Description: AUDIO MAGNETIC XDCR 2-4V SMD; Height: 3mm; Temperature: -30°C to +85°C; Temperature Range Low: -30°C; Lead Free: Yes; ComponentLink2Description: Datasheet; Device Class L1: Electromechanical; RoHS: TRUE; Category: Speak; Automotive: No; Temperature Range High: +85°C; Manufacturer Part Number: ST-025BH
C101 = TR3D226M035C0400: Capacitor Polarised; Manufacturer_Name: Vishay; Datasheet Link: http://www.vishay.com/doc?40080; Height: 3.1mm; Manufacturer_Part_Number: TR3D226M035C0400
C102-C106 C201-C210 C301 C302 C401-C407 C509 C601-C604 = CMP-2006-01550-1: Manufacturer: Vitramon; Part Number: VJ0603Y104KXQCW1BC
CAN0_TRAN = CMP-0315-00015-3: IC TRANSCEIVER HALF 1/1 8SOIC; Number of Transceivers: 1; Operating Supply Voltage: 3.3V; Number of I/Os: 2; Max Supply Current: 17mA; Max Supply Voltage: 3.6V; Min Supply Voltage: 3V; Data Rate: 1Mbps; Min Operating Temperature: -40°C; Packaging: Tape and Reel; Lead Free: Lead Free; Number of Transmit Buffers: 1; Max Operating Temperature: 85°C; Number of Receive Buffers: 1; Number of Pins: 8; Package Quantity: 1; Radiation Hardening: No; Case/Package: D; REACH SVHC: No SVHC; Weight: 0.002561oz; Termination: SMD/SMT; Contact Plating: Gold; Nominal Supply Current: 17mA; Number of Receivers: 1; Number of Drivers: 1
D1 D2 = CMP-12791-000030-1: DIODE GEN PURP 1KV 3A SMB; Manufacturer: Diodes Inc.; Peak Reverse Current: 10uA; Max Junction Temp: +150°C; Reverse Voltage: 1000V; Standoff Height: 0.05mm; Max Surge Forward Current: 100A; Capacitance: 40pF; Value: 40pF; Automotive: No; Device Class L1: Discrete Semiconductors; ComponentLink2Description: Datasheet; Temperature Range Low: -65°C; Lead Free: Yes; Height: 2.5mm; Device Class L3: Rectifier Diodes; Footprint Url: https://www.diodes.com/assets/Package-Files/SMB.pdf; Device Class L2: Diodes; Octopart: https://octopart.com/s3mb-13-f-diodes+inc.-333387; Temperature: -65°C to +150°C; ComponentLink2URL: https://www.diodes.com/assets/Datasheets/ds16005.pdf; RoHS: TRUE; Max Repetitive Reverse Voltage: 1000V; Package: SMB; Digikey Description: DIODE GEN PURP 1KV 3A SMB; Category: Diode; Manufacturer Part Number: S3MB-13-F; Forward Current: 3A; Mouser Description: Rectifiers 1000V 3A; Temperature Range High: +150°C
DS1-DS4 = CMP-1426-00006-4: WL-SMCW SMD Chip LED Top View Monocolor Waterclear, 30 mA, 2 V, -40 to 85 degC, 2-Pin SMD, RoHS, Tape and Reel; DatasheetVersion: Rev. 2.7; PackageDescription: 2-Pin Surface Mount Device, Body 1.6 x 0.8 mm; ComponentLink1URL: https://www.we-online.com/; PartNumber: 150060VS75000; RoHSCompliant: True; ComponentLink2URL: http://katalog.we-online.de/led/datasheet/150060VS75000.pdf; ComponentLink1Description: Manufacturer URL; Mounting Technology: Surface Mount; ComponentLink2Description: Datasheet
F1 = CMP-08605-000061-1: FUSE BRD MNT 1A 125VAC/VDC 2SMD; Manufacturer: Littelfuse Inc; Resistance: 0.078Ω; Max Fuse Ac Voltage: 125V; Fuse Interrupt Dc Current: 300A; Fuse I2T: 0.6029A2Sec; Fuse Blow Speed: Fast; Value: 0.078Ω; Fuse Interrupt Ac Current: 50A; RoHS: TRUE; Octopart: https://octopart.com/0451001.mrl-littelfuse-566368; Temperature Range High: +125°C; Temperature: -55°C to +125°C; ComponentLink2Description: Datasheet; Voltage Rating: 125V; Digikey Description: FUSE BRD MNT 1A 125VAC/VDC 2SMD; Mouser Description: Surface Mount Fuses 125V 1A; Fuse Current: 1A; Device Class L1: Circuit Protection; Package: 0451; Lead Free: Yes; Device Class L3: unset; Category: Fuse; Automotive: No; Temperature Range Low: -55°C; ComponentLink2URL: https://www.littelfuse.com/~/media/electronics/datasheets/fuses/littelfuse_fuse_451_453_datasheet.pdf.pdf; Max Fuse Dc Voltage: 125V; Device Class L2: Fuses; Manufacturer Part Number: 0451001.MRL; Height: 2.94mm
FB1 = CMP-0220-00030-1: SMD EMI Suppression Ferrite Bead WE-CBF, Z = 120 Ohm; Impedance: 120 Ohm; PackageDescription: Chip Inductor, 2-Leads, Body 2.0 x 1.2 mm; ComponentLink2URL: http://www.we-online.de/katalog/media/pdf/742792023.pdf; ComponentLink1Description: Manufacturer Link; ComponentLink2Description: Datasheet; DatasheetVersion: Dec-2005; PackageReference: SMD-0805; ComponentLink1URL: http://www.we-online.com; PackageVersion: 2005
FB2 FB3 = CMP-0220-00181-1: SMD EMI Suppression Ferrite Bead WE-CBF, Z = 600 Ohm; Impedance: 600 Ohm; PackageReference: SMD-0603; PackageVersion: 2009; ComponentLink2Description: Datasheet; ComponentLink1Description: Manufacturer Link; ComponentLink2URL: http://www.we-online.de/katalog/media/pdf/742792651.pdf; DatasheetVersion: Dec-2005; ComponentLink1URL: http://www.we-online.com; PackageDescription: Chip Inductor, 2-Leads, Body 1.6 x 0.8 mm
FB5-FB9 = CMP-0686-00279-4: Chip Ferrite Bead, 0402, 1000Ω @ 100MHz, 1.25Ω, 25%, 250mA; Manufacturer Series: BLM15H; Number of Functions: 1; DC Resistance-Max: 1.25R; Impedance: 1kR; Shielding: Unshielded; Material: Steel; Series: BLM15H; Case Code (Metric): 1005; Contact Plating: Tin; Width: 0.5mm; Current Rating: 250mA; Number of Circuits: 1; Min Operating Temperature: -55°C; Number of Pins: 2; Core Material: Ferrite; Packaging: Tape and Reel; DC Resistance (DCR): 1.25R; Height: 0.5mm; REACH SVHC: No SVHC; Max Current Rating: 250mA; Depth: 0.5mm; Tolerance: 25%; Termination: SMD/SMT; RoHS Compliant: Yes; Package Quantity: 1; Number of Lines: 1; Max DC Current: 250mA; Radiation Hardening: No; Resistance: 1.25R; Lead Free: Lead Free; DC Current: 250mA; Length: 1mm; Test Frequency: 100MHz; Frequency: 100MHz; Case Code (Imperial): 0402; Max Operating Temperature: 125°C; Case/Package: 0402; Military Standard: Not
GPS = CMP-207130-000004-3: RF RX GALILEO 1.575GHZ/1.602GHZ; Manufacturer: uBlox; Nominal Supply Current: 9.5-32mA; Sensitivity: -165dBm; Automotive Grade: Grade 3; Max Frequency: 1602MHz; Min Supply Voltage: 2.7V; Max Supply Voltage: 3.6V; Data Rate: 400kbits/s; Interface: I2C,UART,Other; Package: 0; ComponentLink2Description: Datasheet; Octopart: https://octopart.com/sam-m8q-0-10-u-blox-88247750; Temperature Range Low: -40°C; Height: 6.8mm; Category: IC; RoHS: TRUE; Digikey Description: RF RX GALILEO 1.575GHZ/1.602GHZ; Footprint Url: https://www.u-blox.com/sites/default/files/SAM-M8Q_HardwareIntegrationManual_%28UBX-16018358%29.pdf; ComponentLink2URL: https://www.u-blox.com/sites/default/files/SAM-M8Q_DataSheet_%28UBX-16012619%29.pdf; Temperature Range High: +85°C; Device Class L1: Integrated Circuits (ICs); Temperature: -40°C to +85°C; Automotive: Yes; Device Class L2: RF Semiconductors and Devices; Manufacturer Part Number: SAM-M8Q-0-10; Device Class L3: Transceivers; Lead Free: Yes
IMU1 = CMP-2000-05075-4: IMU ACCEL/GYRO/MAG I2C 28LGA; Sensor Type: Accelerometer; Packaging: Tape and Reel; Case/Package: LGA; Min Operating Temperature: -40°C; Mount: Surface Mount; Output Type: I2C; Lead Free: Lead Free; Max Operating Temperature: 85°C
IMU2 = CMP-191067-000009-1: IMU ACCEL/GYRO I2C/SPI 16LGA; Axis: X, Y, Z; Sensor Type: Accelerometer; Output Type: SPI; Sensitivity: 128LSB/g; Interface: I2C; Bandwidth: 8Hz; Mount: Surface Mount; Case/Package: LGA; Lead Free: Lead Free; Max Operating Temperature: 85°C; Packaging: Tape and Reel; Min Operating Temperature: -40°C; Number of Pins: 16; Package Quantity: 5000
JP1-JP4 R101-R107 R201 R301-R308 R401-R403 R405-R408 R601-R603 = Res3: Resistor; Published: 8-Jun-2000; LatestRevisionDate: 29-May-2009; LatestRevisionNote: IPC-7351 Footprint Added.; PackageReference: J1-0603; Publisher: Altium Limited; PackageDescription: Chip Resistor
LoRa_Misc LoRa_SPI NRF_Misc NRF_SPI = B4B-XH-A(LF)(SN): XH Series 4 Position 2.5 mm Pitch Through Hole Crimp Top Entry Shrouded Header; MF: {'manufacturer': u'JST Sales America Inc.'}; Value: *; Price: None; Availability: Unavailable; Package: None; MP: B4B-XH-A(LF)(SN)
MCU = COMPONENT_1
MUX = SN74CB3Q3251RGYR: Integrated Circuit; Manufacturer_Name: Texas Instruments; Datasheet Link: http://www.ti.com/lit/gpn/sn74cb3q3251; Manufacturer_Part_Number: SN74CB3Q3251RGYR
Primary_Connector = G125-MH15005M4P: Connector; Manufacturer_Name: Harwin; Datasheet Link: https://cdn.harwin.com/pdfs/G125-MH1XX05M4P.pdf; Height: 5.3mm; Manufacturer_Part_Number: G125-MH15005M4P; Mouser Part Number: 855-G125MH1505M4PM4P; Mouser Price/Stock: https://www.mouser.co.uk/ProductDetail/Harwin/G125-MH15005M4P?qs=vHuUswq2%252Bsyt0BUylu0n%252Bg%3D%3D
Q10 = CMP-12801-000103-1: MOSFET N-CH 20V 4.2A SOT23; Fall Time: 6.7ns; Threshold Voltage: 1V; Element Configuration: Single; FET Type: 1 N-Channel; Rise Time: 9.8ns; Max Power Dissipation: 800mW; Rds On Max: 90mR; Number of Channels: 1; Gate to Source Voltage (Vgs): 8V; Turn-On Delay Time: 7.4ns; Turn-Off Delay Time: 28.1ns; Input Capacitance: 594.3pF; Drain to Source Voltage (Vdss): 20V; Width: 1.4mm; Package Quantity: 3000; Max Operating Temperature: 150°C; Packaging: Tape and Reel; Mount: Surface Mount; Number of Pins: 3; Min Operating Temperature: -55°C; Weight: 0.000282oz; REACH SVHC: No SVHC; Number of Elements: 1; Radiation Hardening: No; Length: 3mm; Height: 1mm; Lead Free: Lead Free; Drain to Source Breakdown Voltage: 20V; On-State Resistance: 90MR; Case/Package: SOT-23-3; Continuous Drain Current (ID): 4.2A; Power Dissipation: 800mW; Drain to Source Resistance: 90mR
RS-485 = SN65LBC179D: Integrated Circuit; Manufacturer_Name: Texas Instruments; Datasheet Link: http://www.ti.com/lit/gpn/sn65lbc179; Height: 1.75mm; Manufacturer_Part_Number: SN65LBC179D
SD = CMP-2000-05825-1: Micro SD Card, RA, -25 to 85 degC, 8-Pin SMD, RoHS, Tape and Reel; Voltage Rating: 10VAC/DC; Number of Contacts: 8; Insertion - Extraction Style: Push-Pull; Pitch: 1.1mm; Mating Cycles: 10000; Brand: Molex; Current Rating: 500mA; Manufacturer URL: http://www.molex.com/; Card Type: microSD; Mounting Type: Standard; Height: 1.42mm; Mounting Technology: SurfaceMount; Contact Plating: Gold; Product Category: MemoryCardConnectors; Package Description: 8-Pin Surface Mount Device, Body 11.95 x 11.4 mm, Pitch 1.1 mm; Datasheet URL: http://www.molex.com/pdm_docs/sd/1040310811_sd.pdf; Termination Style: SMD; Length: 11.4mm; Housing Material: LiquidCrystalPolymer(LCP); Orientation: RightAngle; RoHS: True; Contact Material: PhosphorBronze; Datasheet Version: Rev. E, 04/2006; Packaging: Reel; Manufacturer: Molex; Series: 104031; Product: CardConnectors; Number of Rows: 1Row; Package Reference: 104031-0811
Secondary_Connector = G125-MH12605M4P: Connector; Manufacturer_Name: Harwin; Datasheet Link: https://cdn.harwin.com/pdfs/G125-MH1XX05M4P.pdf; Height: 5.3mm; Manufacturer_Part_Number: G125-MH12605M4P; Mouser Part Number: 855-G125MH1265M4PM4P; Mouser Price/Stock: https://www.mouser.co.uk/ProductDetail/Harwin/G125-MH12605M4P?qs=vHuUswq2%252BsyDONvvJZj7dA%3D%3D
USB = CMP-2000-05610-1: Right Angle Female Type AB Micro USB Connector, 30 V, 1.8 A, -30 to 85 degC, RoHS, Tape and Reel; Number of Ports: 1Port; Current Rating: 1.8A; Brand: Molex; Connector Type: MicroUSBTypeABreceptacle; Number of Contacts: 5Contact; Voltage Rating: 30VAC; Color: Black; Product: MicroUSBTypeABConnectors; Package URL: http://www.molex.com/pdm_docs/sd/475890001_sd.pdf; Contact Plating: Gold; Datasheet URL: http://www.molex.com/webdocs/datasheets/pdf/en-us/0475890001_IO_CONNECTORS.pdf; Operating Temperature Range: -20Cto+85C; Termination Style: SMD/SMT; Mounting Angle: Right; Package Reference: 47589-0001; Gender: Female; Package Description: Micro USB Connector, Pitch 0.65 mm, 5 Positions, Body 7.5 x 5.6 mm; Mounting Technology: SurfaceMount; Contact Material: CopperAlloy; Packaging: Reel; RoHS: True; Standard: USB; Manufacturer URL: http://www.molex.com/; Manufacturer: Molex; Datasheet Version: 12/2016; Product Category: USBConnectors; Series: 47589
Y1 = CMP-2000-05279-2: CRYSTAL 16.0000MHZ 8PF SMD; Series Resistance: 80R; Frequency: 16MHz; Frequency Tolerance: 15ppm; Frequency Stability: 25ppm; Mount: Surface Mount; Height: 0.022inch; Length: 0.098inch; ESR (Equivalent Series Resistance): 80R; Packaging: Tape and Reel; Min Operating Temperature: -40°C; Width: 0.079inch; Number of Pins: 4; Case/Package: SMD/SMT; Max Operating Temperature: 85°C; Load Capacitance: 8pF; Package Quantity: 3000
Y2 = CMP-40224-000024-1: CRYSTAL 32.7680KHZ 12.5PF SMD; Tolerance: 20ppm; ESR (Equivalent Series Resistance): 90kR; Frequency Stability: -0.03ppm; Frequency: 32.768kHz; Width: 1.2mm; Package Quantity: 1; Lead Free: Lead Free; Case/Package: SMD/SMT; Termination: SMD/SMT; Min Operating Temperature: -40°C; Height: 0.024inch; Number of Pins: 2; Max Operating Temperature: 85°C; Frequency Tolerance: 20ppm; Mount: Surface Mount; Packaging: Tape and Reel; Length: 0.079inch; Load Capacitance: 12.5pF